# Altium project COB with RK3399.PrjPcb (part 5 of 5)
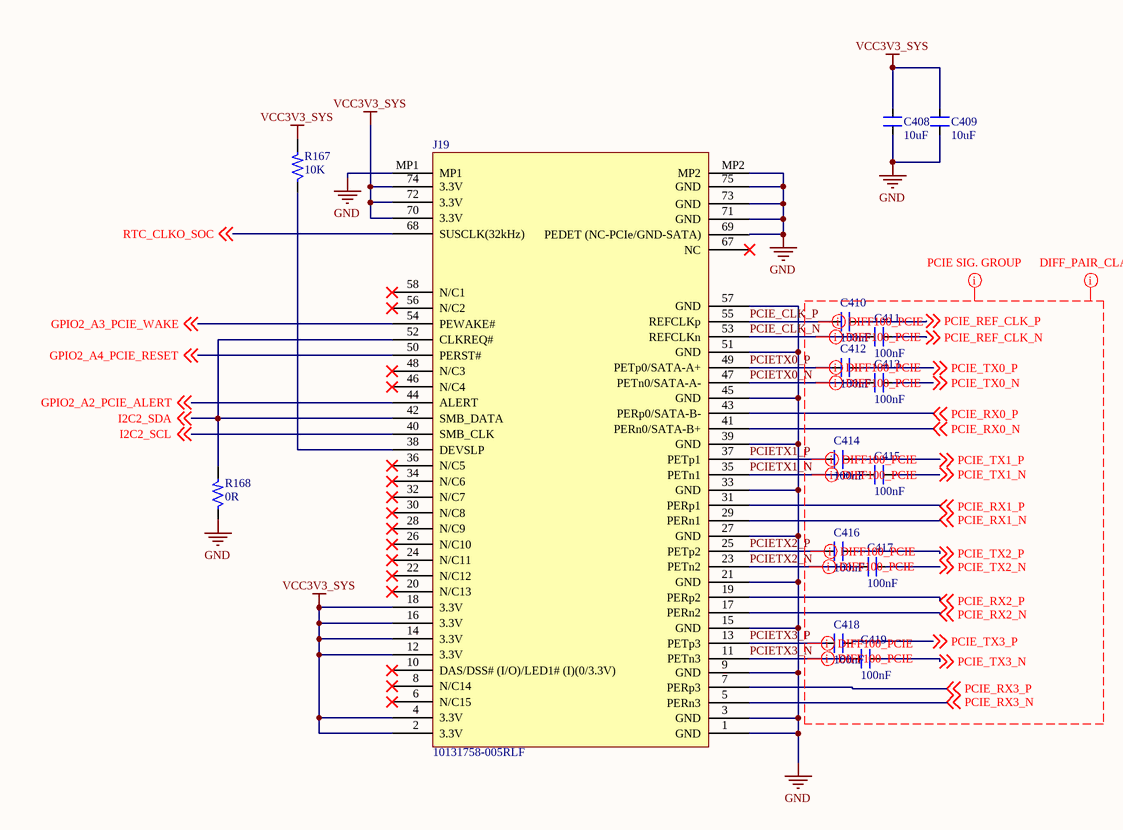
[diagram p27: PCIE Connector.SchDoc]

## Nets that join several sheets
GND: Power Supply Page for RK3399 (279 pins), System PMU for RK3399 (15 pins), RK3399 Side of LPDDR4 Controller (20 pins), LPDDR4 SDRAM_1 (104 pins), LPDDR4 SDRAM_2 (104 pins), SDMMC EMMC PCIE ADC Blocks (9 pins), HDMI_MIPI-DSI_EDP (18 pins), TYPEC_USB2.0 (16 pins), I2C_GPIOs_MIPI-CSI (6 pins), RGMII_SDIO_I2S (10 pins), PMIC_Block (57 pins), EMMC with RK3399 (19 pins), WIFI Module Page (26 pins), Regulators and Buck Converters (33 pins), Power Supply for CPU Blocks (56 pins), RGMII ETH PHY (29 pins), RJ45 Connector and ESD Diodes (6 pins), HDMI Connector for RK3399 (20 pins), TYPEC0 Connector (37 pins), USB2.0 Host Connectors (18 pins), MIPI CSI 0 and 1 Connectors (35 pins), EDP and MIPI DSI Connectors (25 pins), CODEC and Headphone Jack (FB14.2), SD Card and Debug Uart (20 pins), 40 Pin BS, FAN Connector and Test LEDs (21 pins), PCIE Connector (20 pins)
VCC1V8_CAM: PMIC_Block (C241.2 U5.31), MIPI CSI 0 and 1 Connectors (J9.6 J10.6 R133.1)
VCC3V3_S3: TYPEC_USB2.0 (6 pins), RGMII_SDIO_I2S (C209.2 U1.J23), PMIC_Block (C249.2 U5.7), EMMC with RK3399 (7 pins), RGMII ETH PHY (C326.2 C327.2 R97.1), EDP and MIPI DSI Connectors (R137.1), 40 Pin BS, FAN Connector and Test LEDs (R162.2)
VCC3V3_S5: PMIC_Block (8 pins), Regulators and Buck Converters (C288.2 U8.6), Power Supply for CPU Blocks (5 pins)
VCC3V3_SYS: System PMU for RK3399 (C62.2 U2.1), PMIC_Block (26 pins), WIFI Module Page (FB11.2), Regulators and Buck Converters (5 pins), Power Supply for CPU Blocks (21 pins), HDMI Connector for RK3399 (R123.2), TYPEC0 Connector (C354.2 U17.4), MIPI CSI 0 and 1 Connectors (8 pins), EDP and MIPI DSI Connectors (J12.17 J12.18), SD Card and Debug Uart (C404.2 U25.1), 40 Pin BS, FAN Connector and Test LEDs (C407.2 J16.1 J16.17 R164.2), PCIE Connector (12 pins)
VCC5V0_SYS: Regulators and Buck Converters (5 pins), HDMI Connector for RK3399 (F2.1 R120.2 R121.2), TYPEC0 Connector (7 pins), USB2.0 Host Connectors (C367.2 R130.2 U19.5), MIPI CSI 0 and 1 Connectors (6 pins), EDP and MIPI DSI Connectors (J11.1 J11.2 J11.3), SD Card and Debug Uart (J15.2), 40 Pin BS, FAN Connector and Test LEDs (C406.2 J16.2 J16.4 R163.2)
VCC12V0_SYS: PMIC_Block (C256.1), Regulators and Buck Converters (14 pins), EDP and MIPI DSI Connectors (J12.28 J12.29 J12.30), 40 Pin BS, FAN Connector and Test LEDs (Q7.2 R157.2 R158.2)
VCC_0V9: System PMU for RK3399 (FB1.1 U1.T24), RK3399 Side of LPDDR4 Controller (FB4.2 FB5.2), SDMMC EMMC PCIE ADC Blocks (C172.2 C178.2 U1.L24 U1.W24), HDMI_MIPI-DSI_EDP (6 pins), TYPEC_USB2.0 (8 pins), Power Supply for CPU Blocks (C310.2 L9.2 R79.2)
VCC_1V5: RGMII_SDIO_I2S (C210.2 C214.2 U1.AC8 U1.N23), PMIC_Block (C247.2 U5.2)
VCC_1V8: System PMU for RK3399 (FB2.1 FB3.2), SDMMC EMMC PCIE ADC Blocks (5 pins), HDMI_MIPI-DSI_EDP (8 pins), TYPEC_USB2.0 (6 pins), I2C_GPIOs_MIPI-CSI (12 pins), RGMII_SDIO_I2S (C208.2 C212.2 U1.AB8 U1.J22), PMIC_Block (6 pins), EMMC with RK3399 (9 pins), WIFI Module Page (C274.2 C275.2 R65.2 U7.34), Power Supply for CPU Blocks (5 pins), HDMI Connector for RK3399 (Q5.2 Q5.5), 40 Pin BS, FAN Connector and Test LEDs (J18.1 R159.2 U26.3 U26.6)
VCC_3V0: RGMII_SDIO_I2S (10 pins), PMIC_Block (C238.2 C248.2 U5.15 U5.17), Power Supply for CPU Blocks (R91.1), HDMI Connector for RK3399 (Q6.1 R122.2), CODEC and Headphone Jack (R149.2), SD Card and Debug Uart (R153.2 R154.2), 40 Pin BS, FAN Connector and Test LEDs (U26.7)
VCC_DDR: RK3399 Side of LPDDR4 Controller (44 pins), LPDDR4 SDRAM_1 (43 pins), LPDDR4 SDRAM_2 (43 pins), PMIC_Block (5 pins)
VCC_DDRC: LPDDR4 SDRAM_1 (41 pins), LPDDR4 SDRAM_2 (41 pins), PMIC_Block (C257.2 Q1.2)
VCC_SDIO: SDMMC EMMC PCIE ADC Blocks (C174.2 U1.T23), PMIC_Block (C245.2 U5.12)
VCCA1V8_CODEC: RGMII_SDIO_I2S (5 pins), PMIC_Block (C244.2 U5.5), CODEC and Headphone Jack (9 pins)
VCCA3V0_CODEC: PMIC_Block (C246.2 U5.14), CODEC and Headphone Jack (C392.2 C393.2 C394.2 U24.1)
VDD_CENTER: Power Supply Page for RK3399 (17 pins), PMIC_Block (C223.2 C224.2 L2.1 U5.39)
VDD_CPU_B: Power Supply Page for RK3399 (23 pins), Power Supply for CPU Blocks (6 pins)
VDD_CPU_L: Power Supply Page for RK3399 (14 pins), PMIC_Block (C227.2 C228.2 L4.1 U5.29)
VDD_GPU: Power Supply Page for RK3399 (15 pins), Power Supply for CPU Blocks (5 pins)
VDD_LOG: Power Supply Page for RK3399 (20 pins), Power Supply for CPU Blocks (C321.2 L11.2 R87.2)
ADC_IN0: SDMMC EMMC PCIE ADC Blocks (U1.AG26), 40 Pin BS, FAN Connector and Test LEDs (J18.4)
ADC_IN2: SDMMC EMMC PCIE ADC Blocks (U1.AG25), 40 Pin BS, FAN Connector and Test LEDs (J18.5)
ADC_IN3: SDMMC EMMC PCIE ADC Blocks (U1.AG28), 40 Pin BS, FAN Connector and Test LEDs (J18.6)
BT_HOST_WAKE_L: System PMU for RK3399 (U1.AA25), WIFI Module Page (U7.50)
BT_REG_ON_H: System PMU for RK3399 (U1.V30), WIFI Module Page (U7.38)
BT_WAKE_L: RGMII_SDIO_I2S (U1.AL4), WIFI Module Page (U7.49)
CPU_B_SLEEP: RGMII_SDIO_I2S (U1.M27), Power Supply for CPU Blocks (U12.A1)
DDR0_A0: RK3399 Side of LPDDR4 Controller (U1.F2), LPDDR4 SDRAM_1 (U3.H2 U3.R2)
DDR0_A1: RK3399 Side of LPDDR4 Controller (U1.F1), LPDDR4 SDRAM_1 (U3.J2 U3.P2)
DDR0_A2: RK3399 Side of LPDDR4 Controller (U1.G1), LPDDR4 SDRAM_1 (U3.H9 U3.R9)
DDR0_A3: RK3399 Side of LPDDR4 Controller (U1.G2), LPDDR4 SDRAM_1 (U3.H10 U3.R10)
DDR0_A4: RK3399 Side of LPDDR4 Controller (U1.H2), LPDDR4 SDRAM_1 (U3.H11 U3.R11)
DDR0_A5: RK3399 Side of LPDDR4 Controller (U1.H1), LPDDR4 SDRAM_1 (U3.J11 U3.P11)
DDR0_CKE0: RK3399 Side of LPDDR4 Controller (U1.E1), LPDDR4 SDRAM_1 (U3.J4 U3.P4)
DDR0_CKE1: RK3399 Side of LPDDR4 Controller (U1.F5), LPDDR4 SDRAM_1 (U3.J5 U3.P5)
DDR0_CLK1_N: RK3399 Side of LPDDR4 Controller (U1.J5), LPDDR4 SDRAM_1 (U3.P9)
DDR0_CLK1_P: RK3399 Side of LPDDR4 Controller (U1.H5), LPDDR4 SDRAM_1 (U3.P8)
DDR0_CLK_N: RK3399 Side of LPDDR4 Controller (U1.J4), LPDDR4 SDRAM_1 (U3.J9)
DDR0_CLK_P: RK3399 Side of LPDDR4 Controller (U1.H4), LPDDR4 SDRAM_1 (U3.J8)
DDR0_CS0N: RK3399 Side of LPDDR4 Controller (U1.M6), LPDDR4 SDRAM_1 (U3.H4)
DDR0_CS1N: RK3399 Side of LPDDR4 Controller (U1.B1), LPDDR4 SDRAM_1 (U3.H3)
DDR0_CS2N: RK3399 Side of LPDDR4 Controller (U1.M5), LPDDR4 SDRAM_1 (U3.R4)
DDR0_CS3N: RK3399 Side of LPDDR4 Controller (U1.C2), LPDDR4 SDRAM_1 (U3.R3)
DDR0_D0: RK3399 Side of LPDDR4 Controller (U1.AB2), LPDDR4 SDRAM_1 (U3.B2)
DDR0_D1: RK3399 Side of LPDDR4 Controller (U1.AB1), LPDDR4 SDRAM_1 (U3.C2)
DDR0_D2: RK3399 Side of LPDDR4 Controller (U1.AA2), LPDDR4 SDRAM_1 (U3.E2)
DDR0_D3: RK3399 Side of LPDDR4 Controller (U1.AA1), LPDDR4 SDRAM_1 (U3.F2)
DDR0_D4: RK3399 Side of LPDDR4 Controller (U1.Y2), LPDDR4 SDRAM_1 (U3.F4)
DDR0_D5: RK3399 Side of LPDDR4 Controller (U1.Y1), LPDDR4 SDRAM_1 (U3.E4)
DDR0_D6: RK3399 Side of LPDDR4 Controller (U1.W1), LPDDR4 SDRAM_1 (U3.C4)
DDR0_D7: RK3399 Side of LPDDR4 Controller (U1.W2), LPDDR4 SDRAM_1 (U3.B4)
DDR0_D8: RK3399 Side of LPDDR4 Controller (U1.AF2), LPDDR4 SDRAM_1 (U3.B11)
DDR0_D9: RK3399 Side of LPDDR4 Controller (U1.AE2), LPDDR4 SDRAM_1 (U3.C11)
DDR0_D10: RK3399 Side of LPDDR4 Controller (U1.AF1), LPDDR4 SDRAM_1 (U3.E11)
DDR0_D11: RK3399 Side of LPDDR4 Controller (U1.AD2), LPDDR4 SDRAM_1 (U3.F11)
DDR0_D12: RK3399 Side of LPDDR4 Controller (U1.AE1), LPDDR4 SDRAM_1 (U3.F9)
DDR0_D13: RK3399 Side of LPDDR4 Controller (U1.AD1), LPDDR4 SDRAM_1 (U3.E9)
DDR0_D14: RK3399 Side of LPDDR4 Controller (U1.AC1), LPDDR4 SDRAM_1 (U3.C9)
DDR0_D15: RK3399 Side of LPDDR4 Controller (U1.AC2), LPDDR4 SDRAM_1 (U3.B9)
DDR0_D16: RK3399 Side of LPDDR4 Controller (U1.V1), LPDDR4 SDRAM_1 (U3.AA2)
DDR0_D17: RK3399 Side of LPDDR4 Controller (U1.V2), LPDDR4 SDRAM_1 (U3.Y2)
DDR0_D18: RK3399 Side of LPDDR4 Controller (U1.U1), LPDDR4 SDRAM_1 (U3.V2)
DDR0_D19: RK3399 Side of LPDDR4 Controller (U1.U2), LPDDR4 SDRAM_1 (U3.U2)
DDR0_D20: RK3399 Side of LPDDR4 Controller (U1.T1), LPDDR4 SDRAM_1 (U3.U4)
DDR0_D21: RK3399 Side of LPDDR4 Controller (U1.T2), LPDDR4 SDRAM_1 (U3.V4)
DDR0_D22: RK3399 Side of LPDDR4 Controller (U1.R2), LPDDR4 SDRAM_1 (U3.Y4)
DDR0_D23: RK3399 Side of LPDDR4 Controller (U1.R1), LPDDR4 SDRAM_1 (U3.AA4)
DDR0_D24: RK3399 Side of LPDDR4 Controller (U1.P1), LPDDR4 SDRAM_1 (U3.AA11)
DDR0_D25: RK3399 Side of LPDDR4 Controller (U1.P2), LPDDR4 SDRAM_1 (U3.Y11)
DDR0_D26: RK3399 Side of LPDDR4 Controller (U1.N1), LPDDR4 SDRAM_1 (U3.V11)
DDR0_D27: RK3399 Side of LPDDR4 Controller (U1.M1), LPDDR4 SDRAM_1 (U3.U11)
DDR0_D28: RK3399 Side of LPDDR4 Controller (U1.N2), LPDDR4 SDRAM_1 (U3.U9)
DDR0_D29: RK3399 Side of LPDDR4 Controller (U1.L1), LPDDR4 SDRAM_1 (U3.V9)
DDR0_D30: RK3399 Side of LPDDR4 Controller (U1.M2), LPDDR4 SDRAM_1 (U3.Y9)
DDR0_D31: RK3399 Side of LPDDR4 Controller (U1.L2), LPDDR4 SDRAM_1 (U3.AA9)
DDR0_DM0: RK3399 Side of LPDDR4 Controller (U1.Y5), LPDDR4 SDRAM_1 (U3.C3)
DDR0_DM1: RK3399 Side of LPDDR4 Controller (U1.AC5), LPDDR4 SDRAM_1 (U3.C10)
DDR0_DM2: RK3399 Side of LPDDR4 Controller (U1.U5), LPDDR4 SDRAM_1 (U3.Y3)
DDR0_DM3: RK3399 Side of LPDDR4 Controller (U1.P5), LPDDR4 SDRAM_1 (U3.Y10)
DDR0_DQS0_N: RK3399 Side of LPDDR4 Controller (U1.AA4), LPDDR4 SDRAM_1 (U3.E3)
DDR0_DQS0_P: RK3399 Side of LPDDR4 Controller (U1.Y4), LPDDR4 SDRAM_1 (U3.D3)
DDR0_DQS1_N: RK3399 Side of LPDDR4 Controller (U1.AD4), LPDDR4 SDRAM_1 (U3.E10)
DDR0_DQS1_P: RK3399 Side of LPDDR4 Controller (U1.AC4), LPDDR4 SDRAM_1 (U3.D10)
DDR0_DQS2_N: RK3399 Side of LPDDR4 Controller (U1.V4), LPDDR4 SDRAM_1 (U3.V3)
DDR0_DQS2_P: RK3399 Side of LPDDR4 Controller (U1.U4), LPDDR4 SDRAM_1 (U3.W3)
DDR0_DQS3_N: RK3399 Side of LPDDR4 Controller (U1.R4), LPDDR4 SDRAM_1 (U3.V10)
DDR0_DQS3_P: RK3399 Side of LPDDR4 Controller (U1.P4), LPDDR4 SDRAM_1 (U3.W10)
DDR0_RST: RK3399 Side of LPDDR4 Controller (U1.L7), LPDDR4 SDRAM_1 (U3.T11)
DDR1_A0: RK3399 Side of LPDDR4 Controller (U1.B10), LPDDR4 SDRAM_2 (U4.H2 U4.R2)
DDR1_A1: RK3399 Side of LPDDR4 Controller (U1.A10), LPDDR4 SDRAM_2 (U4.J2 U4.P2)
DDR1_A2: RK3399 Side of LPDDR4 Controller (U1.B9), LPDDR4 SDRAM_2 (U4.H9 U4.R9)
DDR1_A3: RK3399 Side of LPDDR4 Controller (U1.A9), LPDDR4 SDRAM_2 (U4.H10 U4.R10)
DDR1_A4: RK3399 Side of LPDDR4 Controller (U1.B8), LPDDR4 SDRAM_2 (U4.H11 U4.R11)
DDR1_A5: RK3399 Side of LPDDR4 Controller (U1.A8), LPDDR4 SDRAM_2 (U4.J11 U4.P11)
DDR1_CKE0: RK3399 Side of LPDDR4 Controller (U1.A5), LPDDR4 SDRAM_2 (U4.J4 U4.P4)
DDR1_CKE1: RK3399 Side of LPDDR4 Controller (U1.E6), LPDDR4 SDRAM_2 (U4.J5 U4.P5)
DDR1_CLK1_N: RK3399 Side of LPDDR4 Controller (U1.E8), LPDDR4 SDRAM_2 (U4.P9)
DDR1_CLK1_P: RK3399 Side of LPDDR4 Controller (U1.E9), LPDDR4 SDRAM_2 (U4.P8)
DDR1_CLK_N: RK3399 Side of LPDDR4 Controller (U1.D8), LPDDR4 SDRAM_2 (U4.J9)
DDR1_CLK_P: RK3399 Side of LPDDR4 Controller (U1.D9), LPDDR4 SDRAM_2 (U4.J8)
DDR1_CS0N: RK3399 Side of LPDDR4 Controller (U1.F12), LPDDR4 SDRAM_2 (U4.H4)
DDR1_CS1N: RK3399 Side of LPDDR4 Controller (U1.A2), LPDDR4 SDRAM_2 (U4.H3)
DDR1_CS2N: RK3399 Side of LPDDR4 Controller (U1.F11), LPDDR4 SDRAM_2 (U4.R4)
DDR1_CS3N: RK3399 Side of LPDDR4 Controller (U1.B3), LPDDR4 SDRAM_2 (U4.R3)
DDR1_D0: RK3399 Side of LPDDR4 Controller (U1.B15), LPDDR4 SDRAM_2 (U4.B2)
DDR1_D1: RK3399 Side of LPDDR4 Controller (U1.A15), LPDDR4 SDRAM_2 (U4.C2)
DDR1_D2: RK3399 Side of LPDDR4 Controller (U1.B16), LPDDR4 SDRAM_2 (U4.E2)
DDR1_D3: RK3399 Side of LPDDR4 Controller (U1.A16), LPDDR4 SDRAM_2 (U4.F2)
DDR1_D4: RK3399 Side of LPDDR4 Controller (U1.B17), LPDDR4 SDRAM_2 (U4.F4)
DDR1_D5: RK3399 Side of LPDDR4 Controller (U1.A17), LPDDR4 SDRAM_2 (U4.E4)
DDR1_D6: RK3399 Side of LPDDR4 Controller (U1.A18), LPDDR4 SDRAM_2 (U4.C4)
DDR1_D7: RK3399 Side of LPDDR4 Controller (U1.B18), LPDDR4 SDRAM_2 (U4.B4)
DDR1_D8: RK3399 Side of LPDDR4 Controller (U1.B11), LPDDR4 SDRAM_2 (U4.B11)
DDR1_D9: RK3399 Side of LPDDR4 Controller (U1.B12), LPDDR4 SDRAM_2 (U4.C11)
DDR1_D10: RK3399 Side of LPDDR4 Controller (U1.A11), LPDDR4 SDRAM_2 (U4.E11)
DDR1_D11: RK3399 Side of LPDDR4 Controller (U1.B13), LPDDR4 SDRAM_2 (U4.F11)
DDR1_D12: RK3399 Side of LPDDR4 Controller (U1.A12), LPDDR4 SDRAM_2 (U4.F9)
DDR1_D13: RK3399 Side of LPDDR4 Controller (U1.A13), LPDDR4 SDRAM_2 (U4.E9)
DDR1_D14: RK3399 Side of LPDDR4 Controller (U1.A14), LPDDR4 SDRAM_2 (U4.C9)
DDR1_D15: RK3399 Side of LPDDR4 Controller (U1.B14), LPDDR4 SDRAM_2 (U4.B9)
DDR1_D16: RK3399 Side of LPDDR4 Controller (U1.A19), LPDDR4 SDRAM_2 (U4.AA2)
DDR1_D17: RK3399 Side of LPDDR4 Controller (U1.B19), LPDDR4 SDRAM_2 (U4.Y2)
DDR1_D18: RK3399 Side of LPDDR4 Controller (U1.A20), LPDDR4 SDRAM_2 (U4.V2)
DDR1_D19: RK3399 Side of LPDDR4 Controller (U1.B20), LPDDR4 SDRAM_2 (U4.U2)
DDR1_D20: RK3399 Side of LPDDR4 Controller (U1.A21), LPDDR4 SDRAM_2 (U4.U4)
DDR1_D21: RK3399 Side of LPDDR4 Controller (U1.B21), LPDDR4 SDRAM_2 (U4.V4)
DDR1_D22: RK3399 Side of LPDDR4 Controller (U1.B22), LPDDR4 SDRAM_2 (U4.Y4)
DDR1_D23: RK3399 Side of LPDDR4 Controller (U1.A22), LPDDR4 SDRAM_2 (U4.AA4)
DDR1_D24: RK3399 Side of LPDDR4 Controller (U1.A23), LPDDR4 SDRAM_2 (U4.AA11)
DDR1_D25: RK3399 Side of LPDDR4 Controller (U1.B23), LPDDR4 SDRAM_2 (U4.Y11)
DDR1_D26: RK3399 Side of LPDDR4 Controller (U1.A24), LPDDR4 SDRAM_2 (U4.V11)
DDR1_D27: RK3399 Side of LPDDR4 Controller (U1.A25), LPDDR4 SDRAM_2 (U4.U11)
DDR1_D28: RK3399 Side of LPDDR4 Controller (U1.B24), LPDDR4 SDRAM_2 (U4.U9)
DDR1_D29: RK3399 Side of LPDDR4 Controller (U1.A26), LPDDR4 SDRAM_2 (U4.V9)
DDR1_D30: RK3399 Side of LPDDR4 Controller (U1.B25), LPDDR4 SDRAM_2 (U4.Y9)
DDR1_D31: RK3399 Side of LPDDR4 Controller (U1.B26), LPDDR4 SDRAM_2 (U4.AA9)
DDR1_DM0: RK3399 Side of LPDDR4 Controller (U1.E17), LPDDR4 SDRAM_2 (U4.C3)
DDR1_DM1: RK3399 Side of LPDDR4 Controller (U1.E14), LPDDR4 SDRAM_2 (U4.C10)
DDR1_DM2: RK3399 Side of LPDDR4 Controller (U1.E20), LPDDR4 SDRAM_2 (U4.Y3)
DDR1_DM3: RK3399 Side of LPDDR4 Controller (U1.E23), LPDDR4 SDRAM_2 (U4.Y10)
DDR1_DQS0_N: RK3399 Side of LPDDR4 Controller (U1.D17), LPDDR4 SDRAM_2 (U4.E3)
DDR1_DQS0_P: RK3399 Side of LPDDR4 Controller (U1.D18), LPDDR4 SDRAM_2 (U4.D3)
DDR1_DQS1_N: RK3399 Side of LPDDR4 Controller (U1.D14), LPDDR4 SDRAM_2 (U4.E10)
DDR1_DQS1_P: RK3399 Side of LPDDR4 Controller (U1.D15), LPDDR4 SDRAM_2 (U4.D10)
DDR1_DQS2_N: RK3399 Side of LPDDR4 Controller (U1.D20), LPDDR4 SDRAM_2 (U4.V3)
DDR1_DQS2_P: RK3399 Side of LPDDR4 Controller (U1.D21), LPDDR4 SDRAM_2 (U4.W3)
DDR1_DQS3_N: RK3399 Side of LPDDR4 Controller (U1.D23), LPDDR4 SDRAM_2 (U4.V10)
DDR1_DQS3_P: RK3399 Side of LPDDR4 Controller (U1.D24), LPDDR4 SDRAM_2 (U4.W10)
DDR1_RST: RK3399 Side of LPDDR4 Controller (U1.G11), LPDDR4 SDRAM_2 (U4.T11)
EDP_TX0_N: HDMI_MIPI-DSI_EDP (C181.1), EDP and MIPI DSI Connectors (J12.11)
EDP_TX0_P: HDMI_MIPI-DSI_EDP (C180.1), EDP and MIPI DSI Connectors (J12.12)
EDP_TX1_N: HDMI_MIPI-DSI_EDP (C183.1), EDP and MIPI DSI Connectors (J12.8)
EDP_TX1_P: HDMI_MIPI-DSI_EDP (C182.1), EDP and MIPI DSI Connectors (J12.9)
EDP_TX2_N: HDMI_MIPI-DSI_EDP (C185.1), EDP and MIPI DSI Connectors (J12.5)
EDP_TX2_P: HDMI_MIPI-DSI_EDP (C184.1), EDP and MIPI DSI Connectors (J12.6)
EDP_TX3_N: HDMI_MIPI-DSI_EDP (C187.1), EDP and MIPI DSI Connectors (J12.2)
EDP_TX3_P: HDMI_MIPI-DSI_EDP (C186.1), EDP and MIPI DSI Connectors (J12.3)
EDPAUX_N: HDMI_MIPI-DSI_EDP (U1.A28), EDP and MIPI DSI Connectors (C380.1)
EDPAUX_P: HDMI_MIPI-DSI_EDP (U1.B28), EDP and MIPI DSI Connectors (C379.1)
EFUSE_VQPS_EN_H: System PMU for RK3399 (U2.3), RGMII_SDIO_I2S (U1.AK3)
EMMC_CLKO: SDMMC EMMC PCIE ADC Blocks (R14.2), EMMC with RK3399 (U6.M5)
EMMC_CMD: SDMMC EMMC PCIE ADC Blocks (U1.J31), EMMC with RK3399 (U6.M6)
EMMC_D0: SDMMC EMMC PCIE ADC Blocks (U1.J28), EMMC with RK3399 (U6.A3)
EMMC_D1: SDMMC EMMC PCIE ADC Blocks (U1.J29), EMMC with RK3399 (U6.A4)
EMMC_D2: SDMMC EMMC PCIE ADC Blocks (U1.J30), EMMC with RK3399 (U6.A5)
EMMC_D3: SDMMC EMMC PCIE ADC Blocks (U1.J25), EMMC with RK3399 (U6.B2)
EMMC_D4: SDMMC EMMC PCIE ADC Blocks (U1.J26), EMMC with RK3399 (U6.B3)
EMMC_D5: SDMMC EMMC PCIE ADC Blocks (U1.J27), EMMC with RK3399 (U6.B4)
EMMC_D6: SDMMC EMMC PCIE ADC Blocks (U1.L31), EMMC with RK3399 (U6.B5)
EMMC_D7: SDMMC EMMC PCIE ADC Blocks (U1.K30), EMMC with RK3399 (U6.B6)
EMMC_STRB: SDMMC EMMC PCIE ADC Blocks (U1.K31), EMMC with RK3399 (U6.H5)
GPIO0_B5/LED1_OUT: System PMU for RK3399 (U1.P24), 40 Pin BS, FAN Connector and Test LEDs (R166.1)
GPIO1_A0: RGMII_SDIO_I2S (U1.R25), 40 Pin BS, FAN Connector and Test LEDs (J16.7)
GPIO1_A1: RGMII_SDIO_I2S (U1.T31), 40 Pin BS, FAN Connector and Test LEDs (J16.11)
GPIO1_A2_CC_INT_L: RGMII_SDIO_I2S (U1.R26), TYPEC0 Connector (U17.5)
GPIO1_A3: RGMII_SDIO_I2S (U1.R27), 40 Pin BS, FAN Connector and Test LEDs (J16.13)
GPIO1_A4: RGMII_SDIO_I2S (U1.R28), 40 Pin BS, FAN Connector and Test LEDs (J16.15)
GPIO1_B5_TP_RST: RGMII_SDIO_I2S (U1.M24), EDP and MIPI DSI Connectors (J11.14 J12.22)
GPIO1_C2: RGMII_SDIO_I2S (U1.N31), 40 Pin BS, FAN Connector and Test LEDs (J16.12)
GPIO1_C4_TP_INT: RGMII_SDIO_I2S (U1.M29), EDP and MIPI DSI Connectors (J11.8 J12.21)
GPIO1_C6: RGMII_SDIO_I2S (U1.L25), 40 Pin BS, FAN Connector and Test LEDs (J16.16)
GPIO1_C7: RGMII_SDIO_I2S (U1.M31), 40 Pin BS, FAN Connector and Test LEDs (J16.18)
GPIO1_D0: RGMII_SDIO_I2S (U1.L26), 40 Pin BS, FAN Connector and Test LEDs (J16.22)
GPIO2_A2_PCIE_ALERT: I2C_GPIOs_MIPI-CSI (U1.H30), PCIE Connector (J19.44)
GPIO2_A3_PCIE_WAKE: I2C_GPIOs_MIPI-CSI (U1.F28), PCIE Connector (J19.54)
GPIO2_A4_PCIE_RESET: I2C_GPIOs_MIPI-CSI (U1.H29), PCIE Connector (J19.50)
GPIO2_A6_FAN_TACH: I2C_GPIOs_MIPI-CSI (U1.H27), 40 Pin BS, FAN Connector and Test LEDs (D32.A R159.1)
GPIO2_B3_CIF_CLKOUTA: I2C_GPIOs_MIPI-CSI (U1.H31), MIPI CSI 0 and 1 Connectors (R132.1 R135.1)
GPIO3_D4: RGMII_SDIO_I2S (U1.AE5), 40 Pin BS, FAN Connector and Test LEDs (J16.37)
GPIO3_D5: RGMII_SDIO_I2S (U1.AA6), 40 Pin BS, FAN Connector and Test LEDs (J16.38)
GPIO3_D6: RGMII_SDIO_I2S (U1.AH2), 40 Pin BS, FAN Connector and Test LEDs (J16.40)
GPIO4_C0/I2C3_SDA: RGMII_SDIO_I2S (U1.AG6), 40 Pin BS, FAN Connector and Test LEDs (J16.10)
GPIO4_C1/I2C3_SCL: RGMII_SDIO_I2S (U1.AL2), 40 Pin BS, FAN Connector and Test LEDs (J16.8)
GPIO4_C5/SPDIF_TX: RGMII_SDIO_I2S (U1.AK1), 40 Pin BS, FAN Connector and Test LEDs (J16.26)
GPIO4_C6/PWM1: RGMII_SDIO_I2S (U1.AL3), 40 Pin BS, FAN Connector and Test LEDs (R161.1)
GPIO4_D2: RGMII_SDIO_I2S (U1.AH3), TYPEC0 Connector (U18.4)
GPIO4_D5_LCD_BL_EN: RGMII_SDIO_I2S (U1.AJ3), EDP and MIPI DSI Connectors (J11.12 J12.24 R138.2)
GPIO4_D6_LCD_RST_H: RGMII_SDIO_I2S (U1.AG4), EDP and MIPI DSI Connectors (J11.13)
GPU_SLEEP: RGMII_SDIO_I2S (U1.M25), Power Supply for CPU Blocks (U10.A1)
HDMI_CEC: RGMII_SDIO_I2S (U1.AD7), HDMI Connector for RK3399 (Q6.2 R122.1)
HDMI_TX0_N: HDMI_MIPI-DSI_EDP (U1.AL17), HDMI Connector for RK3399 (D12.2)
HDMI_TX0_P: HDMI_MIPI-DSI_EDP (U1.AK17), HDMI Connector for RK3399 (D12.1)
HDMI_TX1_N: HDMI_MIPI-DSI_EDP (U1.AL18), HDMI Connector for RK3399 (D11.2)
HDMI_TX1_P: HDMI_MIPI-DSI_EDP (U1.AK18), HDMI Connector for RK3399 (D11.1)
HDMI_TX2_N: HDMI_MIPI-DSI_EDP (U1.AL19), HDMI Connector for RK3399 (D10.2)
HDMI_TX2_P: HDMI_MIPI-DSI_EDP (U1.AK19), HDMI Connector for RK3399 (D10.1)
HDMI_TXCLK_N: HDMI_MIPI-DSI_EDP (U1.AL16), HDMI Connector for RK3399 (D13.2)
HDMI_TXCLK_P: HDMI_MIPI-DSI_EDP (U1.AK16), HDMI Connector for RK3399 (D13.1)
HOST0_D_N: TYPEC_USB2.0 (U1.AB31), USB2.0 Host Connectors (D22.1)
HOST0_D_P: TYPEC_USB2.0 (U1.AB30), USB2.0 Host Connectors (D22.2)
HOST1_D_N: TYPEC_USB2.0 (U1.AA31), USB2.0 Host Connectors (D23.1)
HOST1_D_P: TYPEC_USB2.0 (U1.AA30), USB2.0 Host Connectors (D23.2)
HP_DET_H: RGMII_SDIO_I2S (U1.AH5), CODEC and Headphone Jack (C399.2 R149.1 R150.2)
I2C1_SCL: RGMII_SDIO_I2S (R50.1 U1.Y6), MIPI CSI 0 and 1 Connectors (J9.9), CODEC and Headphone Jack (U24.35)
I2C1_SDA: RGMII_SDIO_I2S (R49.1 U1.AG1), MIPI CSI 0 and 1 Connectors (J9.10), CODEC and Headphone Jack (U24.36)
I2C2_SCL: I2C_GPIOs_MIPI-CSI (R31.1 U1.H25), MIPI CSI 0 and 1 Connectors (J10.9), 40 Pin BS, FAN Connector and Test LEDs (J16.28 U26.5), PCIE Connector (J19.40)
I2C2_SDA: I2C_GPIOs_MIPI-CSI (R30.1 U1.G31), MIPI CSI 0 and 1 Connectors (J10.10), 40 Pin BS, FAN Connector and Test LEDs (J16.27 U26.4), PCIE Connector (J19.42 J19.52 R168.2)
I2C4_SCL: TYPEC0 Connector (U17.6), EDP and MIPI DSI Connectors (J11.6 J12.20)
I2C4_SDA: TYPEC0 Connector (U17.7), EDP and MIPI DSI Connectors (J11.5 J12.19)
I2C7_SCL_HDMI: I2C_GPIOs_MIPI-CSI (R32.1 U1.H28), HDMI Connector for RK3399 (Q5.4)
I2C7_SDA_HDMI: I2C_GPIOs_MIPI-CSI (R33.1 U1.G30), HDMI Connector for RK3399 (Q5.1)
I2C_SCL_PMIC: RGMII_SDIO_I2S (R43.1 U1.N30), PMIC_Block (U5.19), Power Supply for CPU Blocks (U10.A3 U12.A3)
I2C_SDA_PMIC: RGMII_SDIO_I2S (R46.1 U1.M26), PMIC_Block (U5.18), Power Supply for CPU Blocks (U10.B1 U12.B1)
I2S0_LRCK_RX: RGMII_SDIO_I2S (U1.AF4), CODEC and Headphone Jack (R145.1)
I2S0_LRCK_TX: RGMII_SDIO_I2S (U1.AJ2), CODEC and Headphone Jack (R142.1)
I2S0_SCLK: RGMII_SDIO_I2S (U1.AG3), CODEC and Headphone Jack (R143.1)
I2S0_SDI0: RGMII_SDIO_I2S (U1.Y7), CODEC and Headphone Jack (R140.1)
I2S0_SDO0: RGMII_SDIO_I2S (U1.AH1), CODEC and Headphone Jack (R141.1)
I2S1_LRCK_RX: RGMII_SDIO_I2S (U1.AA7), 40 Pin BS, FAN Connector and Test LEDs (J16.29)
I2S1_LRCK_TX: RGMII_SDIO_I2S (U1.AJ1), 40 Pin BS, FAN Connector and Test LEDs (J16.31)
I2S1_SCLK: RGMII_SDIO_I2S (U1.AF3), 40 Pin BS, FAN Connector and Test LEDs (J16.33)
I2S1_SDI0: RGMII_SDIO_I2S (U1.AD6), 40 Pin BS, FAN Connector and Test LEDs (J16.35)
I2S1_SDO0: RGMII_SDIO_I2S (U1.AC6), 40 Pin BS, FAN Connector and Test LEDs (J16.36)
I2S_CLK: RGMII_SDIO_I2S (U1.AC7), CODEC and Headphone Jack (R144.1), 40 Pin BS, FAN Connector and Test LEDs (J16.32)
LOG_DVS_PWM: RGMII_SDIO_I2S (U1.M28), Power Supply for CPU Blocks (R88.1 R91.2)
MAC_COL: RGMII_SDIO_I2S (U1.D27), RGMII ETH PHY (R112.1 U16.33)
MAC_CRS: RGMII_SDIO_I2S (U1.B27), RGMII ETH PHY (C336.2 R103.1 U16.29)
MAC_MCLK: RGMII_SDIO_I2S (R40.2), RGMII ETH PHY (R104.1)
MAC_MDC: RGMII_SDIO_I2S (U1.E29), RGMII ETH PHY (U16.30)
MAC_MDIO: RGMII_SDIO_I2S (U1.G26), RGMII ETH PHY (R101.1 U16.31)
MAC_RXCLK: RGMII_SDIO_I2S (U1.F25), RGMII ETH PHY (R106.1)
MAC_RXD0: RGMII_SDIO_I2S (U1.E26), RGMII ETH PHY (R117.1 U16.14)
MAC_RXD1: RGMII_SDIO_I2S (U1.F27), RGMII ETH PHY (U16.16)
MAC_RXD2: RGMII_SDIO_I2S (U1.E30), RGMII ETH PHY (R118.1 U16.17)
MAC_RXD3: RGMII_SDIO_I2S (U1.E25), RGMII ETH PHY (R119.1 U16.18)
MAC_RXDV: RGMII_SDIO_I2S (U1.C27), RGMII ETH PHY (R111.2 U16.13)
MAC_RXER: RGMII_SDIO_I2S (U1.F23), RGMII ETH PHY (R102.1 U16.20)
MAC_TXCLK: RGMII_SDIO_I2S (R42.2), RGMII ETH PHY (R107.1)
MAC_TXD0: RGMII_SDIO_I2S (R38.2), RGMII ETH PHY (U16.23)
MAC_TXD1: RGMII_SDIO_I2S (R39.2), RGMII ETH PHY (U16.24)
MAC_TXD2: RGMII_SDIO_I2S (R36.2), RGMII ETH PHY (U16.25)
MAC_TXD3: RGMII_SDIO_I2S (R37.2), RGMII ETH PHY (U16.26)
MAC_TXEN: RGMII_SDIO_I2S (R41.2), RGMII ETH PHY (U16.27)
MDI0_N: RGMII ETH PHY (U16.2), RJ45 Connector and ESD Diodes (D8.2 J4.2)
MDI0_P: RGMII ETH PHY (U16.1), RJ45 Connector and ESD Diodes (D8.1 J4.1)
MDI1_N: RGMII ETH PHY (U16.5), RJ45 Connector and ESD Diodes (D8.5 J4.4)
MDI1_P: RGMII ETH PHY (U16.4), RJ45 Connector and ESD Diodes (D8.4 J4.3)
MDI2_N: RGMII ETH PHY (U16.8), RJ45 Connector and ESD Diodes (D9.2 J4.6)
MDI2_P: RGMII ETH PHY (U16.7), RJ45 Connector and ESD Diodes (D9.1 J4.5)
MDI3_N: RGMII ETH PHY (U16.11), RJ45 Connector and ESD Diodes (D9.5 J4.8)
MDI3_P: RGMII ETH PHY (U16.10), RJ45 Connector and ESD Diodes (D9.4 J4.7)
MIPI_CSI0_PWN: RGMII_SDIO_I2S (U1.AF8), MIPI CSI 0 and 1 Connectors (J9.12)
MIPI_CSI0_RST: RGMII_SDIO_I2S (U1.AD9), MIPI CSI 0 and 1 Connectors (J9.11)
MIPI_CSI1_PWN: System PMU for RK3399 (U1.V26), MIPI CSI 0 and 1 Connectors (J10.12)
MIPI_CSI1_RST: System PMU for RK3399 (U1.U28), MIPI CSI 0 and 1 Connectors (J10.11)
MIPI_RX0_CLK_N: I2C_GPIOs_MIPI-CSI (U1.AL13), MIPI CSI 0 and 1 Connectors (J9.26)
MIPI_RX0_CLK_P: I2C_GPIOs_MIPI-CSI (U1.AK13), MIPI CSI 0 and 1 Connectors (J9.25)
MIPI_RX0_D0_N: I2C_GPIOs_MIPI-CSI (U1.AL15), MIPI CSI 0 and 1 Connectors (J9.29)
MIPI_RX0_D0_P: I2C_GPIOs_MIPI-CSI (U1.AK15), MIPI CSI 0 and 1 Connectors (J9.28)
MIPI_RX0_D1_N: I2C_GPIOs_MIPI-CSI (U1.AL14), MIPI CSI 0 and 1 Connectors (J9.23)
MIPI_RX0_D1_P: I2C_GPIOs_MIPI-CSI (U1.AK14), MIPI CSI 0 and 1 Connectors (J9.22)
MIPI_RX0_D2_N: I2C_GPIOs_MIPI-CSI (U1.AL12), MIPI CSI 0 and 1 Connectors (J9.20)
MIPI_RX0_D2_P: I2C_GPIOs_MIPI-CSI (U1.AK12), MIPI CSI 0 and 1 Connectors (J9.19)
MIPI_RX0_D3_N: I2C_GPIOs_MIPI-CSI (U1.AL11), MIPI CSI 0 and 1 Connectors (J9.17)
MIPI_RX0_D3_P: I2C_GPIOs_MIPI-CSI (U1.AK11), MIPI CSI 0 and 1 Connectors (J9.16)
MIPI_TX0_CLK_N: HDMI_MIPI-DSI_EDP (U1.AH12), EDP and MIPI DSI Connectors (J11.28)
MIPI_TX0_CLK_P: HDMI_MIPI-DSI_EDP (U1.AG12), EDP and MIPI DSI Connectors (J11.29)
MIPI_TX0_D0_N: HDMI_MIPI-DSI_EDP (U1.AH15), EDP and MIPI DSI Connectors (J11.25)
MIPI_TX0_D0_P: HDMI_MIPI-DSI_EDP (U1.AG15), EDP and MIPI DSI Connectors (J11.26)
MIPI_TX0_D1_N: HDMI_MIPI-DSI_EDP (U1.AH14), EDP and MIPI DSI Connectors (J11.22)
MIPI_TX0_D1_P: HDMI_MIPI-DSI_EDP (U1.AG14), EDP and MIPI DSI Connectors (J11.23)
MIPI_TX0_D2_N: HDMI_MIPI-DSI_EDP (U1.AH11), EDP and MIPI DSI Connectors (J11.19)
MIPI_TX0_D2_P: HDMI_MIPI-DSI_EDP (U1.AG11), EDP and MIPI DSI Connectors (J11.20)
MIPI_TX0_D3_N: HDMI_MIPI-DSI_EDP (U1.AH9), EDP and MIPI DSI Connectors (J11.16)
MIPI_TX0_D3_P: HDMI_MIPI-DSI_EDP (U1.AG9), EDP and MIPI DSI Connectors (J11.17)
MIPI_TX1/RX1_CLK_N: I2C_GPIOs_MIPI-CSI (U1.AL8), MIPI CSI 0 and 1 Connectors (J10.26)
MIPI_TX1/RX1_CLK_P: I2C_GPIOs_MIPI-CSI (U1.AK8), MIPI CSI 0 and 1 Connectors (J10.25)
MIPI_TX1/RX1_D0_N: I2C_GPIOs_MIPI-CSI (U1.AL6), MIPI CSI 0 and 1 Connectors (J10.29)
MIPI_TX1/RX1_D0_P: I2C_GPIOs_MIPI-CSI (U1.AK6), MIPI CSI 0 and 1 Connectors (J10.28)
MIPI_TX1/RX1_D1_N: I2C_GPIOs_MIPI-CSI (U1.AL7), MIPI CSI 0 and 1 Connectors (J10.23)
MIPI_TX1/RX1_D1_P: I2C_GPIOs_MIPI-CSI (U1.AK7), MIPI CSI 0 and 1 Connectors (J10.22)
MIPI_TX1/RX1_D2_N: I2C_GPIOs_MIPI-CSI (U1.AL9), MIPI CSI 0 and 1 Connectors (J10.20)
MIPI_TX1/RX1_D2_P: I2C_GPIOs_MIPI-CSI (U1.AK9), MIPI CSI 0 and 1 Connectors (J10.19)
MIPI_TX1/RX1_D3_N: I2C_GPIOs_MIPI-CSI (U1.AL10), MIPI CSI 0 and 1 Connectors (J10.17)
MIPI_TX1/RX1_D3_P: I2C_GPIOs_MIPI-CSI (U1.AK10), MIPI CSI 0 and 1 Connectors (J10.16)
OTP_OUT_H: RGMII_SDIO_I2S (U1.P26), Power Supply for CPU Blocks (R77.1)
PCIE_REF_CLK_N: SDMMC EMMC PCIE ADC Blocks (U1.AD30), PCIE Connector (C411.2)
PCIE_REF_CLK_P: SDMMC EMMC PCIE ADC Blocks (U1.AD31), PCIE Connector (C410.2)
PCIE_RX0_N: SDMMC EMMC PCIE ADC Blocks (U1.AF31), PCIE Connector (J19.41)
PCIE_RX0_P: SDMMC EMMC PCIE ADC Blocks (U1.AF30), PCIE Connector (J19.43)
PCIE_RX1_N: SDMMC EMMC PCIE ADC Blocks (U1.AH31), PCIE Connector (J19.29)
PCIE_RX1_P: SDMMC EMMC PCIE ADC Blocks (U1.AH30), PCIE Connector (J19.31)
PCIE_RX2_N: SDMMC EMMC PCIE ADC Blocks (U1.AC28), PCIE Connector (J19.17)
PCIE_RX2_P: SDMMC EMMC PCIE ADC Blocks (U1.AC27), PCIE Connector (J19.19)
PCIE_RX3_N: SDMMC EMMC PCIE ADC Blocks (U1.AF28), PCIE Connector (J19.5)
PCIE_RX3_P: SDMMC EMMC PCIE ADC Blocks (U1.AF27), PCIE Connector (J19.7)
PCIE_TX0_N: SDMMC EMMC PCIE ADC Blocks (U1.AE31), PCIE Connector (C413.2)
PCIE_TX0_P: SDMMC EMMC PCIE ADC Blocks (U1.AE30), PCIE Connector (C412.2)
PCIE_TX1_N: SDMMC EMMC PCIE ADC Blocks (U1.AG31), PCIE Connector (C415.2)
PCIE_TX1_P: SDMMC EMMC PCIE ADC Blocks (U1.AG30), PCIE Connector (C414.2)
PCIE_TX2_N: SDMMC EMMC PCIE ADC Blocks (U1.AA28), PCIE Connector (C417.2)
PCIE_TX2_P: SDMMC EMMC PCIE ADC Blocks (U1.AA27), PCIE Connector (C416.2)
PCIE_TX3_N: SDMMC EMMC PCIE ADC Blocks (U1.AD28), PCIE Connector (C419.2)
PCIE_TX3_P: SDMMC EMMC PCIE ADC Blocks (U1.AD27), PCIE Connector (C418.2)
PMIC_EXT_EN: PMIC_Block (U5.55), Regulators and Buck Converters (R69.1 R72.1)
PMIC_INT_L: RGMII_SDIO_I2S (U1.M30), PMIC_Block (C254.2 U5.49)
PMIC_SLEEP_H: RGMII_SDIO_I2S (U1.R30), PMIC_Block (C255.2 Q2.1 U5.50)
PWM0_BL: RGMII_SDIO_I2S (U1.AF5), EDP and MIPI DSI Connectors (J11.10 J12.23)
PWR_KEY_L: System PMU for RK3399 (U1.V27), PMIC_Block (D5.A)
RECOVERY: SDMMC EMMC PCIE ADC Blocks (R17.2), 40 Pin BS, FAN Connector and Test LEDs (D34.K R165.1)
RESET_IN_H: PMIC_Block (C253.2 U5.6), Power Supply for CPU Blocks (Q3.3)
RESET_L: System PMU for RK3399 (R1.1), PMIC_Block (R58.1 U5.20)
RTC_CLKO_SOC: System PMU for RK3399 (U1.U31), PMIC_Block (R56.1 U5.68), PCIE Connector (J19.68)
RTC_CLKO_WIFI: PMIC_Block (R59.1 U5.67), WIFI Module Page (U7.31)
SDIO0_CLK: RGMII_SDIO_I2S (U1.AF7), WIFI Module Page (R67.1)
SDIO0_CMD: RGMII_SDIO_I2S (U1.AH6), WIFI Module Page (R65.1 U7.17)
SDIO0_D0: RGMII_SDIO_I2S (U1.AD8), WIFI Module Page (U7.21)
SDIO0_D1: RGMII_SDIO_I2S (U1.AK5), WIFI Module Page (U7.22)
SDIO0_D2: RGMII_SDIO_I2S (U1.AG7), WIFI Module Page (U7.20)
SDIO0_D3: RGMII_SDIO_I2S (U1.AE8), WIFI Module Page (U7.19)
SDMMC0_CLK: SDMMC EMMC PCIE ADC Blocks (R15.2), SD Card and Debug Uart (R152.1)
SDMMC0_CMD: SDMMC EMMC PCIE ADC Blocks (U1.V25), SD Card and Debug Uart (D27.K J14.3)
SDMMC0_D0: SDMMC EMMC PCIE ADC Blocks (U1.Y27), SD Card and Debug Uart (D25.K J14.7)
SDMMC0_D1: SDMMC EMMC PCIE ADC Blocks (U1.Y26), SD Card and Debug Uart (D24.K J14.8)
SDMMC0_D2: SDMMC EMMC PCIE ADC Blocks (U1.Y28), SD Card and Debug Uart (D29.K J14.1)
SDMMC0_D3: SDMMC EMMC PCIE ADC Blocks (U1.U27), SD Card and Debug Uart (D28.K J14.2)
SDMMC0_PWR_H: System PMU for RK3399 (U1.R29), SD Card and Debug Uart (U25.3)
SPI1_CLK: RGMII_SDIO_I2S (U1.P28), 40 Pin BS, FAN Connector and Test LEDs (J16.23)
SPI1_CSn0: RGMII_SDIO_I2S (U1.P29), 40 Pin BS, FAN Connector and Test LEDs (J16.24)
SPI1_RXD/UART4_RX: RGMII_SDIO_I2S (U1.P27), 40 Pin BS, FAN Connector and Test LEDs (J16.21)
SPI1_TXD/UART4_TX: RGMII_SDIO_I2S (U1.R31), 40 Pin BS, FAN Connector and Test LEDs (J16.19)
TYPEC0_D_N: TYPEC_USB2.0 (U1.AH23), TYPEC0 Connector (D17.1)
TYPEC0_D_P: TYPEC_USB2.0 (U1.AG23), TYPEC0 Connector (D17.2)
TYPEC0_RX1_N: TYPEC_USB2.0 (U1.AL21), TYPEC0 Connector (D19.2)
TYPEC0_RX1_P: TYPEC_USB2.0 (U1.AK21), TYPEC0 Connector (D19.1)
TYPEC0_RX2_N: TYPEC_USB2.0 (U1.AL23), TYPEC0 Connector (D21.1)
TYPEC0_RX2_P: TYPEC_USB2.0 (U1.AK23), TYPEC0 Connector (D21.2)
TYPEC0_SBU1: TYPEC_USB2.0 (U1.AK20), TYPEC0 Connector (C350.1)
TYPEC0_SBU1_DC: TYPEC_USB2.0 (U1.AH17), TYPEC0 Connector (R125.1)
TYPEC0_SBU2: TYPEC_USB2.0 (U1.AL20), TYPEC0 Connector (C351.1)
TYPEC0_SBU2_DC: TYPEC_USB2.0 (U1.AG17), TYPEC0 Connector (R128.1)
TYPEC0_TX1_N: TYPEC_USB2.0 (U1.AK22), TYPEC0 Connector (C353.1)
TYPEC0_TX1_P: TYPEC_USB2.0 (U1.AL22), TYPEC0 Connector (C352.1)
TYPEC0_TX2_N: TYPEC_USB2.0 (U1.AK24), TYPEC0 Connector (C359.1)
TYPEC0_TX2_P: TYPEC_USB2.0 (U1.AL24), TYPEC0 Connector (C360.1)
TYPEC0_U2VBUSDET: TYPEC_USB2.0 (R22.2), TYPEC0 Connector (D15.K R124.1)
UART0_CTS: RGMII_SDIO_I2S (U1.AG8), WIFI Module Page (U7.42)
UART0_RTS: RGMII_SDIO_I2S (U1.AL5), WIFI Module Page (U7.43)
UART0_RXD: RGMII_SDIO_I2S (U1.AE9), WIFI Module Page (U7.40)
UART0_TXD: RGMII_SDIO_I2S (U1.AH8), WIFI Module Page (U7.41)
UART2DBG_RX: RGMII_SDIO_I2S (U1.AK2), SD Card and Debug Uart (R154.1 R156.1)
UART2DBG_TX: RGMII_SDIO_I2S (U1.AJ4), SD Card and Debug Uart (R153.1 R155.1)
VDD_CPU_B_FB: Power Supply Page for RK3399 (U1.N18), Power Supply for CPU Blocks (R82.1 U12.A4)
VDD_GPU_FB: Power Supply Page for RK3399 (U1.T15), Power Supply for CPU Blocks (R76.1 U10.A4)
WIFI_HOST_WAKE_L: System PMU for RK3399 (U1.V31), WIFI Module Page (U7.16)
WIFI_REG_ON_H: System PMU for RK3399 (U1.W31), WIFI Module Page (U7.15)